# EAGLE design hs-256-expansion-long-range (EAGLE 8.3.2)
DESIGNER: Jonathan P. Newman; DESIGN_NAME: headstage-256 Expansion Boards; LICENSE: CERN OHL v1.2; REVISION: 1.0
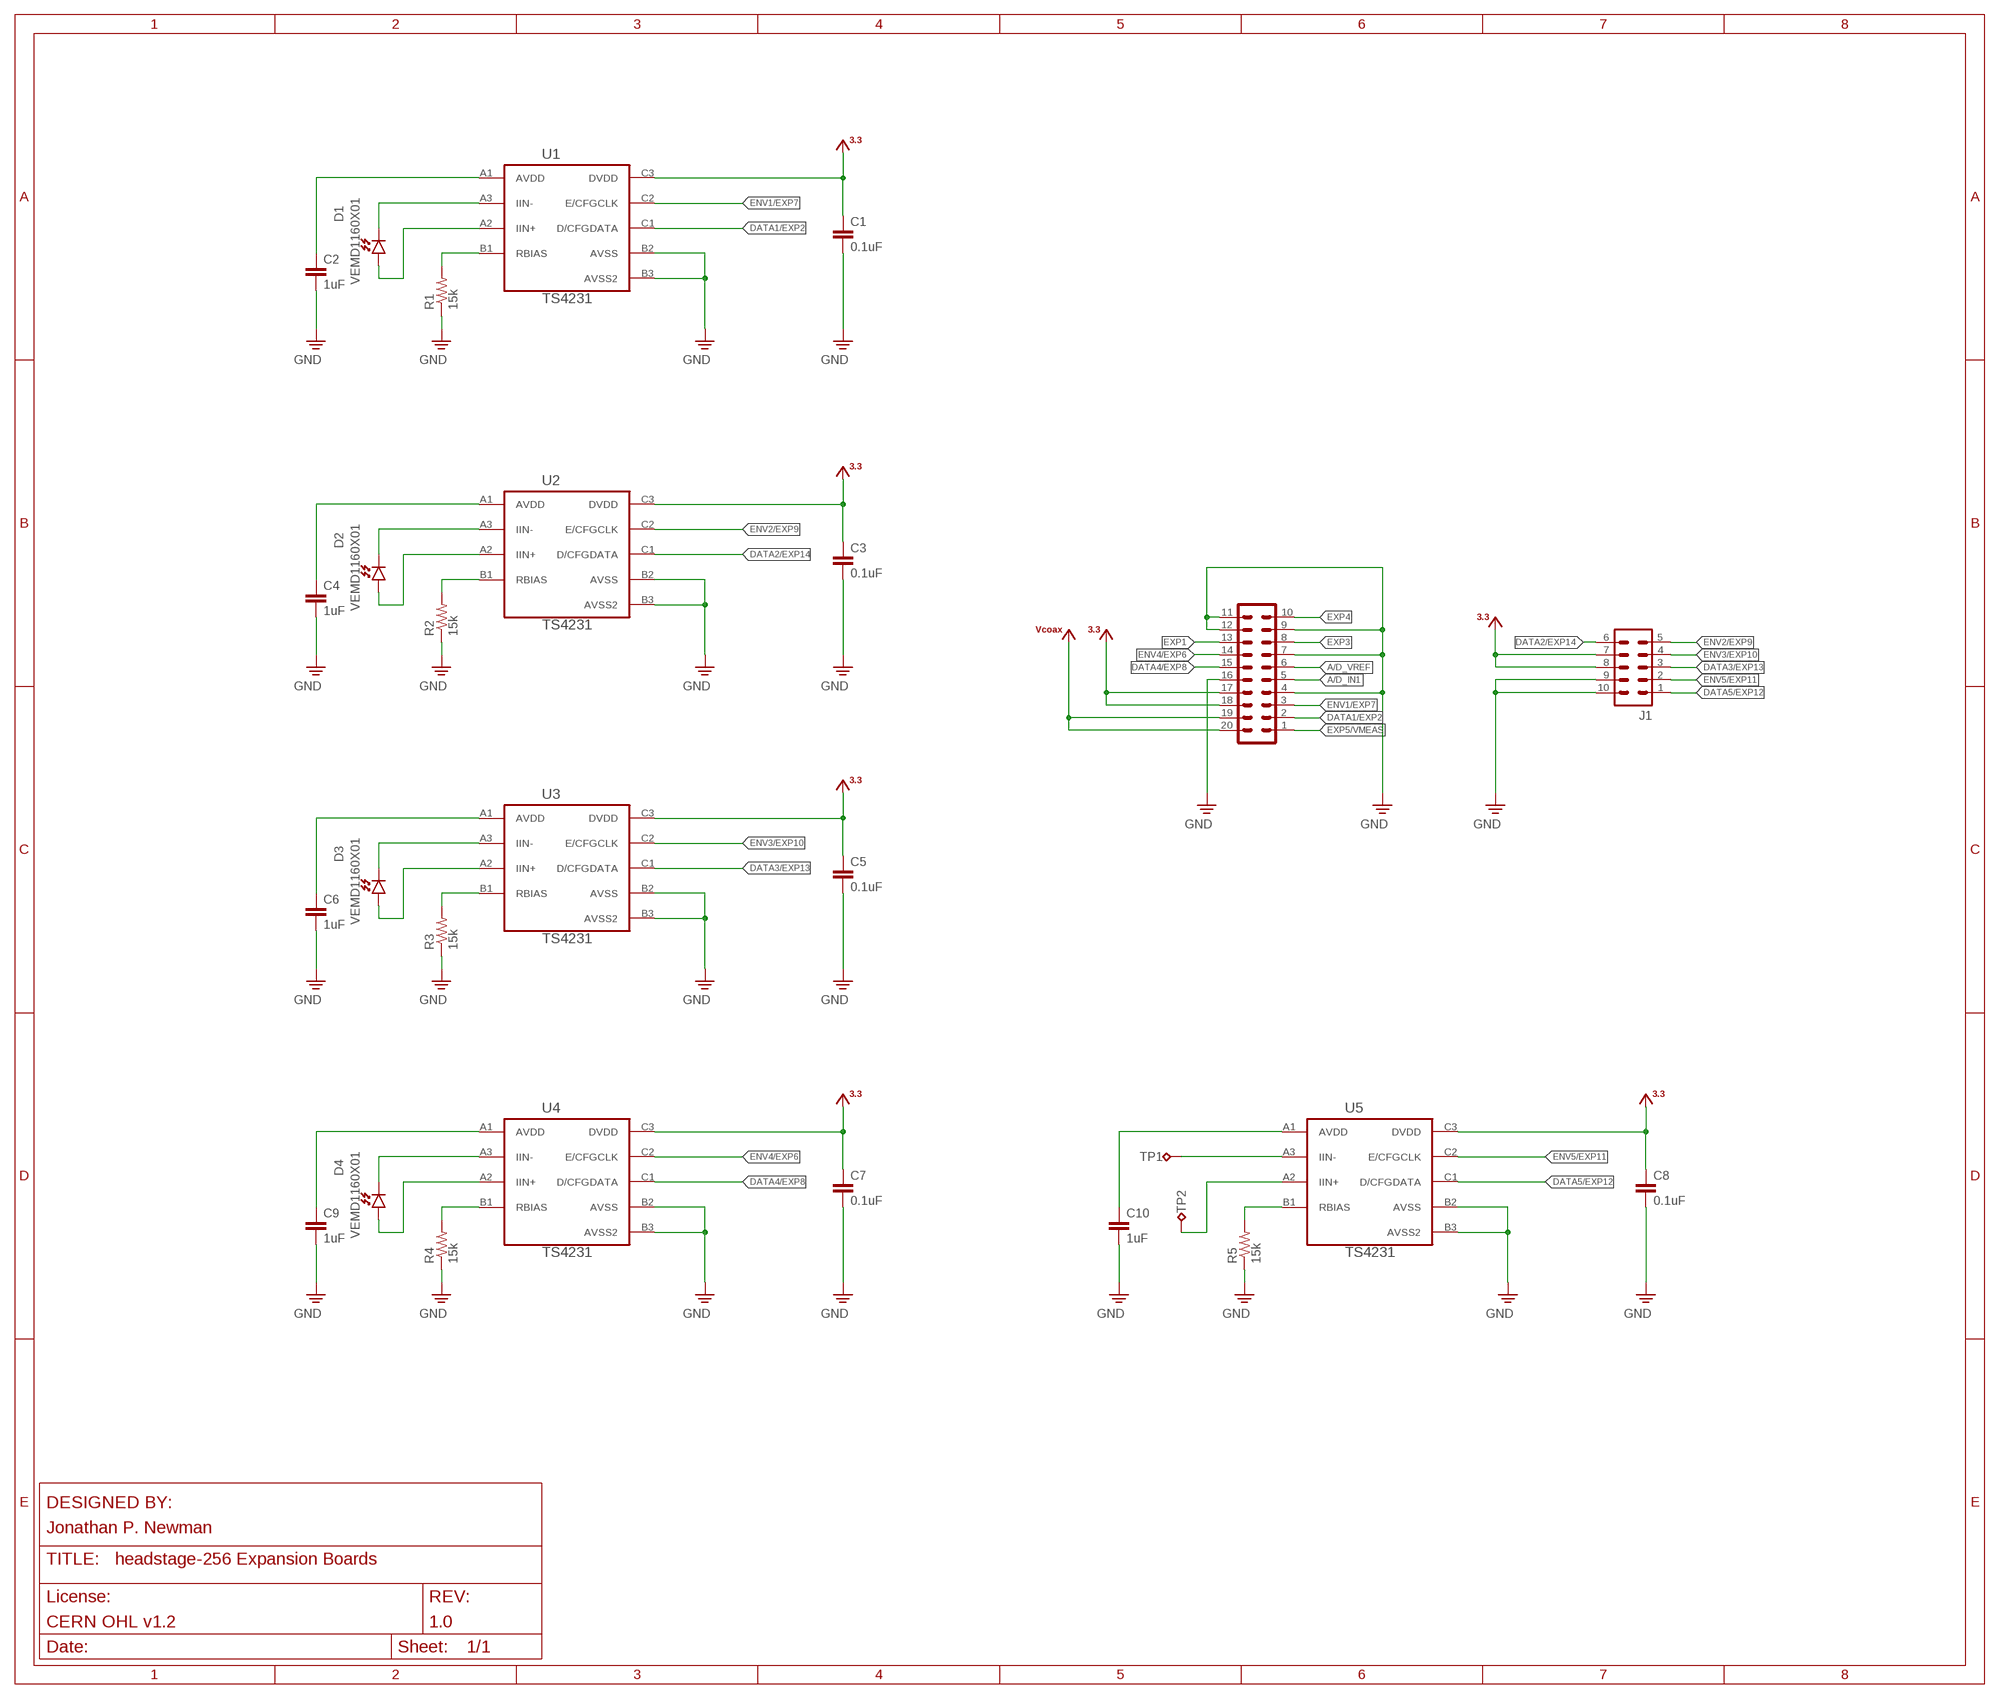
[diagram p0: schematic, sheet 1]

## Parts
C1  0.1uF  C_0201  [0201]
C2  1uF  C_0201  [0201]
C3  0.1uF  C_0201  [0201]
C4  1uF  C_0201  [0201]
C5  0.1uF  C_0201  [0201]
C6  1uF  C_0201  [0201]
C7  0.1uF  C_0201  [0201]
C8  0.1uF  C_0201  [0201]
C9  1uF  C_0201  [0201]
C10  1uF  C_0201  [0201]
D1  VEMD1160X01  PHOTODIODE_SFH2400FA  [SFH2400FA]
D2  VEMD1160X01  PHOTODIODE_SFH2400FA  [SFH2400FA]
D3  VEMD1160X01  PHOTODIODE_SFH2400FA  [SFH2400FA]
D4  VEMD1160X01  PHOTODIODE_SFH2400FA  [SFH2400FA]
J1  PINHD-2X5_DF40-REC  [DF40-10REC]
J2  PINHD-2X10_DF40-20REC  [DF40-20REC]
R1  15k  R_0201  [0201]
R2  15k  R_0201  [0201]
R3  15k  R_0201  [0201]
R4  15k  R_0201  [0201]
R5  15k  R_0201  [0201]
TP1  TPTP20SQ  [TP20SQ]
TP2  TPTP20SQ  [TP20SQ]
U1  TS4231  [WLCSP3X3]
U2  TS4231  [WLCSP3X3]
U3  TS4231  [WLCSP3X3]
U4  TS4231  [WLCSP3X3]
U5  TS4231  [WLCSP3X3]

## Nets
+3V3: C1.1 C3.1 C5.1 C7.1 C8.1 J1.7 J1.8 J2.17 J2.18 U1.C3(DVDD) U2.C3(DVDD) U3.C3(DVDD) U4.C3(DVDD) U5.C3(DVDD)
A/D_IN1: J2.5
A/D_VREF: J2.6
DATA1/EXP2: J2.2 U1.C1(D/CFGDATA)
DATA2/EXP14: J1.6 U2.C1(D/CFGDATA)
DATA3/EXP13: J1.3 U3.C1(D/CFGDATA)
DATA4/EXP8: J2.15 U4.C1(D/CFGDATA)
DATA5/EXP12: J1.1 U5.C1(D/CFGDATA)
ENV1/EXP7: J2.3 U1.C2(E/CFGCLK)
ENV2/EXP9: J1.5 U2.C2(E/CFGCLK)
ENV3/EXP10: J1.4 U3.C2(E/CFGCLK)
ENV4/EXP6: J2.14 U4.C2(E/CFGCLK)
ENV5/EXP11: J1.2 U5.C2(E/CFGCLK)
EXP1: J2.13
EXP3: J2.8
EXP4: J2.10
EXP5/VMEAS: J2.1
GND: C1.2 C2.2 C3.2 C4.2 C5.2 C6.2 C7.2 C8.2 C9.2 C10.2 J1.9 J1.10 J2.4 J2.7 J2.9 J2.11 J2.12 J2.16 R1.1 R2.1 R3.1 R4.1 R5.1 U1.B2(AVSS) U1.B3(AVSS2) U2.B2(AVSS) U2.B3(AVSS2) U3.B2(AVSS) U3.B3(AVSS2) U4.B2(AVSS) U4.B3(AVSS2) U5.B2(AVSS) U5.B3(AVSS2)
N$1: D2.1(C) U2.A3(IIN-)
N$2: D2.3(A) U2.A2(IIN+)
N$3: R2.2 U2.B1(RBIAS)
N$4: C4.1 U2.A1(AVDD)
N$5: D3.1(C) U3.A3(IIN-)
N$6: D3.3(A) U3.A2(IIN+)
N$7: R3.2 U3.B1(RBIAS)
N$8: C6.1 U3.A1(AVDD)
N$9: D4.1(C) U4.A3(IIN-)
N$10: D4.3(A) U4.A2(IIN+)
N$11: R4.2 U4.B1(RBIAS)
N$12: C9.1 U4.A1(AVDD)
N$13: TP1.TP U5.A3(IIN-)
N$14: TP2.TP U5.A2(IIN+)
N$15: R5.2 U5.B1(RBIAS)
N$16: C10.1 U5.A1(AVDD)
N$25: D1.1(C) U1.A3(IIN-)
N$26: D1.3(A) U1.A2(IIN+)
N$27: R1.2 U1.B1(RBIAS)
N$28: C2.1 U1.A1(AVDD)
VCOAX: J2.19 J2.20 ; supply symbol labelled +VCOAX

## Library data of the parts
C1 C3 C5 C7 C8 = jonnew:C: Capacitor; PARTNO: C0603X5R1C104K030BC
C2 C4 C6 C9 C10 = jonnew:C: Capacitor; PARTNO: CL03A105MP3ZSNH
D1-D4 = jonnew:PHOTODIODE
J1 = jonnew:PINHD-2X5
J2 = jonnew:PINHD-2X10
R1-R5 = jonnew:R: Resistor
TP1 TP2 = jonnew:TP: Test pad
U1-U5 = jonnew:TS4231

## Board
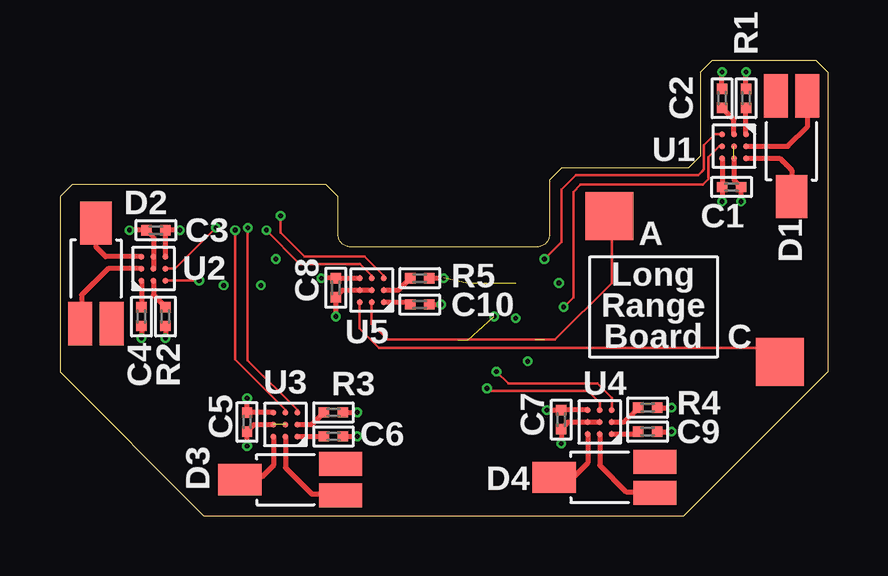
[diagram p1: board, top side]
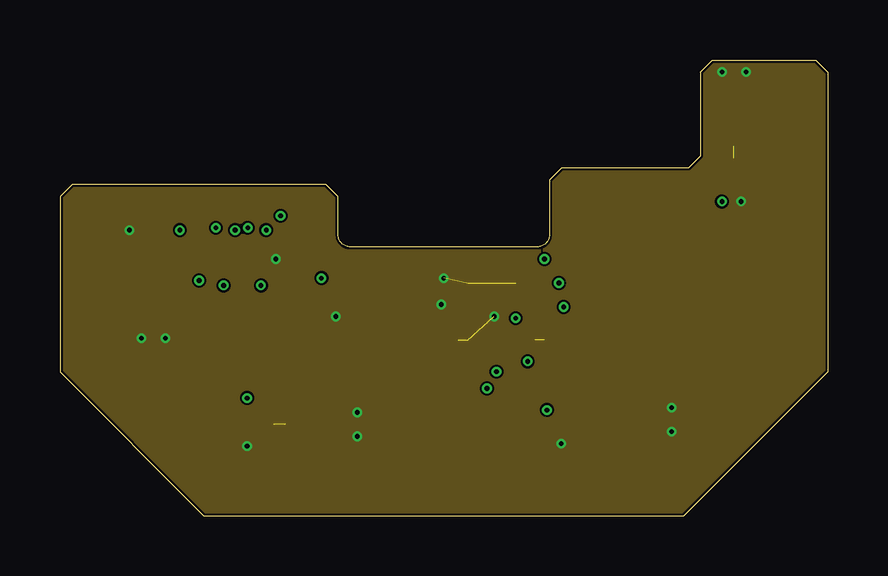
[diagram p2: board, inner layer Route2]
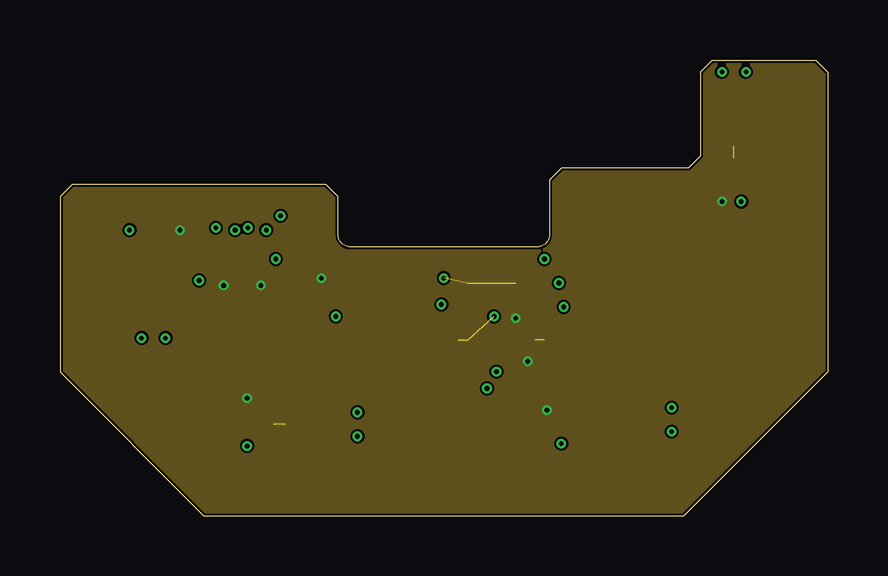
[diagram p3: board, inner layer Route15]
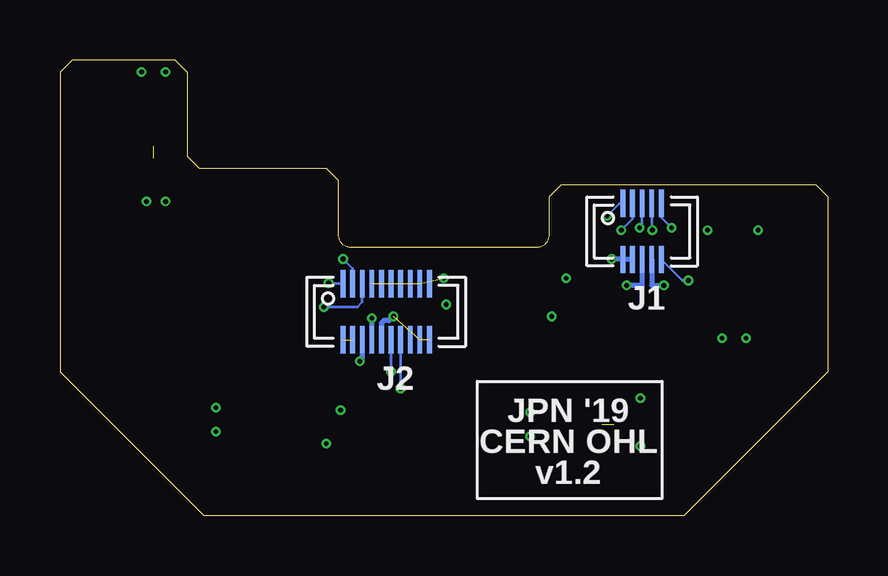
[diagram p4: board, bottom side, seen from below]

Size 32 x 19 mm. Coordinates in mm from the lower left corner, seen from the top.
Outline: 27.2,19 31.5,19 32,18.5 32,6 26,0 6,0 0,6 0,13.3 0.5,13.8 11.1,13.8 11.6,13.3 11.6,11.7 arc90 12.1,11.2 19.9,11.2 arc90 20.4,11.7 20.4,14 20.9,14.5 26.2,14.5 26.7,15 26.7,18.5 27.2,19
Copper layers (1+2*15+16): Top 0.035mm / dielectric 0.2mm / Route2 0.0175mm / dielectric 1.065mm / Route15 0.0175mm / dielectric 0.2mm / Bottom 0.035mm
Design rules "jlcpcb-4-layer_JLC7628-stackup": minimum track width 3.5mil, minimum drill 0.2mm, track to track 3.5mil, track to pad 5mil, pad to pad 5mil, via to via 5mil, smd to smd 0mil, copper to edge 0.1mm, drill to drill 5mil, minimum pad ring 4mil, minimum via ring 4mil, stop-mask expansion 3mil, vias tented up to drill 100mil, thermal gap 10mil

### Footprints (pad centres in the part's own frame; a part is rotated, then mirrored left to right if it is on the bottom)
0201 = smd 0.432 x 0.432: 1 -0.394,0; 2 0.394,0
SFH2400FA = smd 1.8 x 1.3: 1 -2.1,0 | smd 1.8 x 1: 2 2.1,0.65; 3 2.1,-0.65
DF40-10REC = smd 0.2 x 1.14: 1 -0.8,1.17; 2 -0.4,1.17; 3 0,1.17; 4 0.4,1.17; 5 0.8,1.17; 6 0.8,-1.17; 7 0.4,-1.17; 8 0,-1.17; 9 -0.4,-1.17; 10 -0.8,-1.17
DF40-20REC = smd 0.2 x 1.14: 1 -1.8,1.17; 2 -1.4,1.17; 3 -1,1.17; 4 -0.6,1.17; 5 -0.2,1.17; 6 0.2,1.17; 7 0.6,1.17; 8 1,1.17; 9 1.4,1.17; 10 1.8,1.17; 11 1.8,-1.17; 12 1.4,-1.17; 13 1,-1.17; 14 0.6,-1.17; 15 0.2,-1.17; 16 -0.2,-1.17; 17 -0.6,-1.17; 18 -1,-1.17; 19 -1.4,-1.17; 20 -1.8,-1.17
TP20SQ = smd 2 x 2: TP 0,0
WLCSP3X3 = smd 0.25 x 0.25: A1 -0.5,0.5; A2 0,0.5; A3 0.5,0.5; B1 -0.5,0; B2 0,0; B3 0.5,0; C1 -0.5,-0.5; C2 0,-0.5; C3 0.5,-0.5

### Placement (x,y rotation side)
C1  28,13.7 0 top
C2  28.6,17.4 90 top
C3  4,11.9 180 top
C4  3.4,8.3 270 top
C5  7.8,3.9 270 top
C6  11.4,3.3 0 top
C7  20.9,4 270 top
C8  11.5,9.5 270 top
C9  24.5,3.5 0 top
C10  15,8.8 0 top
D1  30.5,15.4 90 top
D2  1.5,10.1 270 top
D3  9.6,1.5 0 top
D4  22.7,1.6 0 top
J1  7.73,11.85 0 bottom
J2  18.4,8.5 0 bottom
R1  27.6,17.4 270 top
R2  4.4,8.3 90 top
R3  11.4,4.3 180 top
R4  24.5,4.5 180 top
R5  15,9.9 180 top
TP1  30,6.4 180 top
TP2  22.9,12.5 180 top
U1  28.1,15.4 270 top
U2  3.9,10.3 90 top
U3  9.4,3.8 180 top
U4  22.5,3.9 180 top
U5  13,9.4 180 top

### Tracks (layer width: path | path; a pad name or v marks a point on that pad's centre or on a via)
+3V3  (via drill 0.2)
  Top 0.2: v5,11.9 C3.1 U2.C3 | U4.C3 C7.1 v20.31,4.39 v20.3,4.4 | U1.C3 C1.1 v27.61,13.11 v27.6,13.1 | U5.C3 C8.1 v10.9,9.9 | U3.C3 C5.1 v7.8,4.9
  Bottom 0.2: J1.7 7.33,9.6 v6.82,9.6 | J1.8 7.73,9.6 v8.38,9.6 | J2.17 v19,8.23 | J2.18 19.4,6.43 v19.5,6.43
  pour Route15 (no thermals): -8.6,30.5 52.2,30.6 52.7,-21.4 -8.6,-21.5
DATA1/EXP2  (via drill 0.2)
  Top 0.1: v20.2,10.7 20.9,11.4 20.9,13.6 21.5,14.2 26.61,14.2 26.76,14.35 26.81,14.39 26.85,14.44 26.85,15.45 27.3,15.9 U1.C1
  Bottom 0.1: J2.2 19.8,10.3 v20.2,10.7
DATA2/EXP14  (via drill 0.2)
  Top 0.1: U2.C1 v5.8,9.8 5.9,9.8
  Bottom 0.1: J1.6 6.05,9.8 v5.8,9.8
DATA3/EXP13  (via drill 0.2)
  Top 0.1: U3.C1 9.9,4.4 7.83,6.47 v7.83,12
  Bottom 0.1: J1.3 7.73,12.1 v7.83,12
DATA4/EXP8  (via drill 0.2)
  Top 0.1: v18.2,6 18.7,5.5 22.4,5.5 23,4.9 U4.C1
  Bottom 0.1: J2.15 18.2,6.4 | 18.2,6.4 18.2,6.1 | 18.2,6.4 v18.2,6
DATA5/EXP12  (via drill 0.2)
  Top 0.1: U5.C1 13.5,10 12.7,10.8 10.2,10.8 9.2,11.8 v9.2,12.5
  Bottom 0.1: J1.1 8.68,13.02 v9.2,12.5
ENV1/EXP7  (via drill 0.2)
  Top 0.1: U1.C2 27.5,15.4 27.04,14.94 27.04,14.04 26.8,13.8 21.7,13.8 21.4,13.5 21.4,9.1 v21,8.7
  Bottom 0.1: J2.3 19.4,8.9 19.6,8.7 v21,8.7
ENV2/EXP9  (via drill 0.2)
  Top 0.1: U2.C2 4.8,10.3 v6.5,12
  Bottom 0.1: J1.5 6.93,12.43 v6.5,12
ENV3/EXP10  (via drill 0.2)
  Top 0.1: v7.3,11.9 7.3,6.5 9.4,4.4 U3.C2
  Bottom 0.1: J1.4 7.33,11.93 v7.3,11.9
ENV4/EXP6  (via drill 0.2)
  Top 0.1: v17.8,5.3 17.9,5.2 22,5.2 22.5,4.7 U4.C2
  Bottom 0.1: J2.14 v17.8,5.3
ENV5/EXP11  (via drill 0.2)
  Top 0.1: U5.C2 13,10 12.5,10.5 10,10.5 v8.6,11.9
  Bottom 0.1: J1.2 8.13,12.37 v8.6,11.9
EXP5/VMEAS  (via drill 0.2)
  Bottom 0.1: J2.1 20.77,9.67 v20.8,9.7
GND  (via drill 0.2)  (7 unrouted)
  Top 0.2: C4.2 v3.4,7.4 | R2.1 v4.4,7.4 | v2.9,11.9 C3.2 3.9,11.61 U2.B3 U2.B2 | v7.8,2.9 C5.2 8.09,3.8 U3.B3 | U4.B2 U4.B3 21.19,3.9 C7.2 v20.9,3 | C9.2 v25.5,3.5 | R4.1 v25.5,4.5 | R1.1 v27.6,18.5 | C2.2 v28.6,18.5 | U1.B3 28.1,13.99 C1.2 v28.39,13.11 v28.4,13.1 | U5.B2 U5.B3 11.79,9.4 C8.2 v11.5,8.3 | C10.2 v15.9,8.8 | R5.1 v16,9.9 | C6.2 v12.4,3.3 | R3.1 v12.4,4.3
  Bottom 0.2: J1.9 J1.10 8.53,10.7 v9,10.7 | v18.1,8.3 18.27,8.13 18.53,8.13 18.53,8.1 | 18.6,8.02 J2.16 | 18.53,8.1 18.6,8.02 | 18.53,8.1 18.6,8.02
  pour Route2 (no thermals): -7.6,29.5 51.2,29.6 51.2,-20.4 -7.6,-20.5
N$1
  Top 0.2: U2.A3 1.9,10.8 1.5,11.2 D2.1
N$2
  Top 0.2: U2.A2 2,10.3 0.9,9.2 0.9,8.05 D2.3
N$3
  Top 0.2: U2.B1 3.9,9.19 R2.2
N$4
  Top 0.2: U2.A1 C4.1
N$5
  Top 0.2: U3.A3 8.9,2.1 8.4,1.6 7.6,1.6 D3.1
N$6
  Top 0.2: U3.A2 9.4,2 10.5,0.9 11.65,0.9 D3.3
N$7
  Top 0.2: U3.B1 10.51,3.8 R3.2
N$8
  Top 0.2: U3.A1 C6.1
N$9
  Top 0.2: U4.A3 22,2.2 21.4,1.6 D4.1
N$10
  Top 0.2: U4.A2 22.5,2.1 23.6,1 24.75,1 D4.3
N$11
  Top 0.2: U4.B1 23.51,3.9 R4.2
N$12
  Top 0.2: U4.A1 24.01,3.4 C9.1
N$13
  Top 0.1: U5.A3 12.5,7.8 13.3,7 29.4,7 TP1.TP
N$14
  Top 0.1: U5.A2 13,8 13.66,7.34 20.64,7.34 23,9.7 23,12.7 | 23,12.7 23,12.8 | TP2.TP 23,12.6 23,12.7
N$15
  Top 0.2: U5.B1 14.11,9.4 R5.2
N$16
  Top 0.2: U5.A1 14.51,8.9 C10.1
N$25
  Top 0.1: D1.1 30.4,13.4
  Top 0.2: U1.A3 30,14.9 30.5,14.4 D1.1
N$26
  Top 0.1: D1.3 31.15,17.3
  Top 0.2: U1.A2 30.35,15.4 31.15,16.2 31.15,17.3
N$27
  Top 0.2: U1.B1 28.1,16.51 R1.2
N$28
  Top 0.2: U1.A1 C2.1
VCOAX  (1 unrouted)

### Text on the board
tPlace: A | Long / Range / Board | C
bPlace: JPN '19 / CERN OHL / v1.2